# EAGLE design targetboard2 (EAGLE 6.5.0)
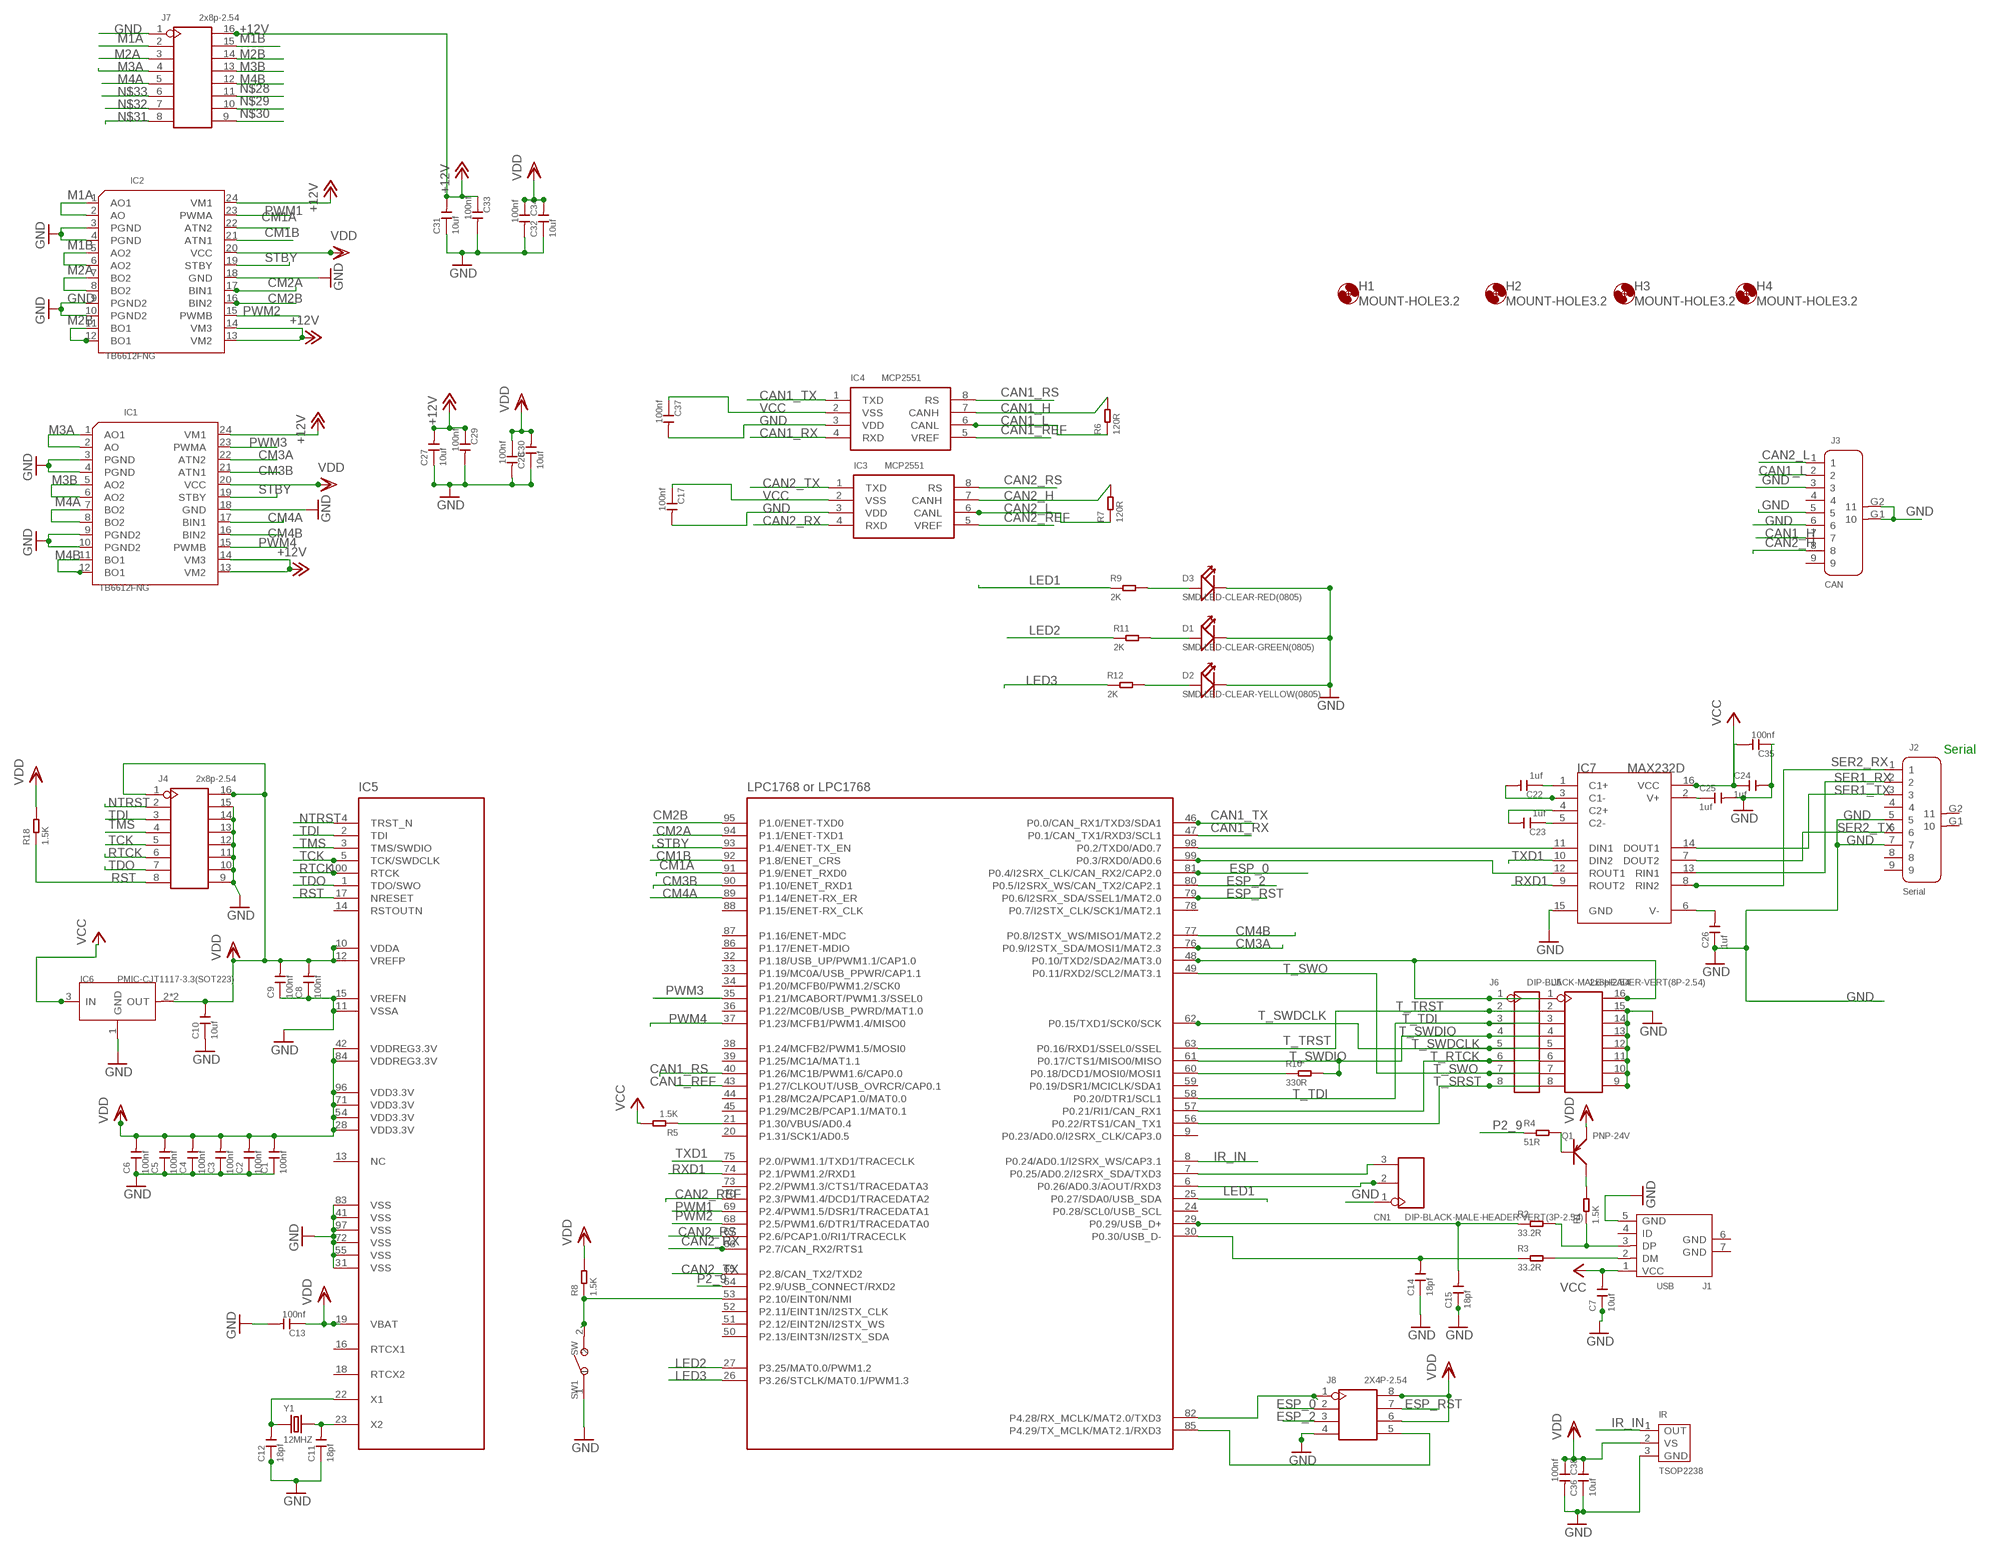
[diagram p0: schematic, sheet 1]

## Parts
C1  100nf  CERAMIC-100NF-50V-10%-X7R(0805)  [C0805]
C2  100nf  CERAMIC-100NF-50V-10%-X7R(0805)  [C0805]
C3  100nf  CERAMIC-100NF-50V-10%-X7R(0805)  [C0805]
C4  100nf  CERAMIC-100NF-50V-10%-X7R(0805)  [C0805]
C5  100nf  CERAMIC-100NF-50V-10%-X7R(0805)  [C0805]
C6  100nf  CERAMIC-100NF-50V-10%-X7R(0805)  [C0805]
C7  10uf  CERAMIC-10UF-10V-10%-X5R(0603)  [C0603]
C8  100nf  CERAMIC-100NF-50V-10%-X7R(0805)  [C0805]
C9  100nf  CERAMIC-100NF-50V-10%-X7R(0805)  [C0805]
C10  10uf  CERAMIC-10UF-25V-10%-X5R(0805)  [C0805]
C11  18pf  CERAMIC-18PF-50V-5%-NPO(0805)  [C0805]
C12  18pf  CERAMIC-18PF-50V-5%-NPO(0805)  [C0805]
C13  100nf  CERAMIC-100NF-50V-10%-X7R(0805)  [C0805]
C14  18pf  CERAMIC-18PF-50V-5%-NPO(0805)  [C0805]
C15  18pf  CERAMIC-18PF-50V-5%-NPO(0805)  [C0805]
C17  100nf  CERAMIC-100NF-50V-10%-X7R(0805)  [C0805]
C22  1uf  CERAMIC-1UF-25V-10%-X7R(0805)  [C0805]
C23  1uf  CERAMIC-1UF-25V-10%-X7R(0805)  [C0805]
C24  1uf  CERAMIC-1UF-25V-10%-X7R(0805)  [C0805]
C25  1uf  CERAMIC-1UF-25V-10%-X7R(0805)  [C0805]
C26  1uf  CERAMIC-1UF-25V-10%-X7R(0805)  [C0805]
C27  10uf  CERAMIC-10UF-25V-10%-X5R(0805)  [C0805]
C28  10uf  CERAMIC-10UF-25V-10%-X5R(0805)  [C0805]
C29  100nf  CERAMIC-100NF-50V-10%-X7R(0805)  [C0805]
C30  100nf  CERAMIC-100NF-50V-10%-X7R(0805)  [C0805]
C31  10uf  CERAMIC-10UF-25V-10%-X5R(0805)  [C0805]
C32  10uf  CERAMIC-10UF-25V-10%-X5R(0805)  [C0805]
C33  100nf  CERAMIC-100NF-50V-10%-X7R(0805)  [C0805]
C34  100nf  CERAMIC-100NF-50V-10%-X7R(0805)  [C0805]
C35  100nf  CERAMIC-100NF-50V-10%-X7R(0805)  [C0805]
C36  10uf  CERAMIC-10UF-25V-10%-X5R(0805)  [C0805]
C37  100nf  CERAMIC-100NF-50V-10%-X7R(0805)  [C0805]
C38  100nf  CERAMIC-100NF-50V-10%-X7R(0805)  [C0805]
CN1  DIP-BLACK-MALE-HEADER-VERT(3P-2.54)  [H3-2.54]
D1  SMD-LED-CLEAR-GREEN(0805)  [LED-0805]
D2  SMD-LED-CLEAR-YELLOW(0805)  [LED-0805]
D3  SMD-LED-CLEAR-RED(0805)  [LED-0805]
H1  MOUNT-HOLE3.2  [3,2]
H2  MOUNT-HOLE3.2  [3,2]
H3  MOUNT-HOLE3.2  [3,2]
H4  MOUNT-HOLE3.2  [3,2]
IC1  TB6612FNG  DRIVER-TB6612FNG-O/C8/EL(SSOP24)  [SSOP24-0.65-8.9X5.3MM]
IC2  TB6612FNG  DRIVER-TB6612FNG-O/C8/EL(SSOP24)  [SSOP24-0.65-8.9X5.3MM]
IC3  MCP2551  INTERFACE-MCP2551-I/SN(SOIC8)  [SOIC8-1.27-5X4MM]
IC4  MCP2551  INTERFACE-MCP2551-I/SN(SOIC8)  [SOIC8-1.27-5X4MM]
IC5  LPC1768 or LPC1768  MCU_LPC1768FBD100(LQFP100)  [LQFP100-0.5-13.8X13.8MM]
IC6  PMIC-CJT1117-3.3(SOT223)  [SOT-223]
IC7  MAX232D  RECEIVER-MAX232D(SOIC16)  [SOIC16-1.27-10X3.9MM]
IR  TSOP2238  OPTICAL-TSOP2238  [SNR3-2.54-6.95X6.0X5.6MM]
J1  USB  MICRO-USB-SMD-TYPE-AB-R/A(ST-USB-001L)  [MICRO-USB5+2P-SMD-0.65]
J2  Serial  DIP-MALE-DB9-CONNECTOR  [DSUB9+2P-2.77-90D-MALE]
J3  CAN  DIP-MALE-DB9-CONNECTOR  [DSUB9+2P-2.77-90D-MALE]
J4  2x8p-2.54  DIP-BLACK-MALE-HEADER-VERT(2X8P-2.54)  [H2X8-2.54]
J5  2x8p-2.54  DIP-BLACK-MALE-HEADER-VERT(2X8P-2.54)  [H2X8-2.54]
J6  DIP-BLACK-MALE-HEADER-VERT(8P-2.54)  [H8-2.54]
J7  2x8p-2.54  DIP-BLACK-MALE-HEADER-VERT(2X8P-2.54)  [H2X8-2.54]
J8  2X4P-2.54  DIP-BLACK-FEMALE-HEADER(2X4P-2.54)  [H2X4-2.54]
Q1  PNP-24V  SMD-TRANSISTORS-PNP-25V-500MA(SOT-23)  [SOT-23]
R1  1.5K  SMD-RES-1.5K-5%-1/16W(0402)  [R0402]
R2  33.2R  SMD-RES-33.2R-1%-1/10W(0603)  [R0603]
R3  33.2R  SMD-RES-33.2R-1%-1/10W(0603)  [R0603]
R4  51R  SMD-RES-51R-1%-1/10W(0603)  [R0603]
R5  1.5K  SMD-RES-1.5K-5%-1/16W(0402)  [R0402]
R6  120R  SMD-RES-120R-5%-1/8W(0805)  [R0805]
R7  120R  SMD-RES-120R-5%-1/8W(0805)  [R0805]
R8  1.5K  SMD-RES-1.5K-5%-1/16W(0402)  [R0402]
R9  2K  SMD-RES-2K-5%-1/8W(0805)  [R0805]
R10  330R  SMD-RES-330R-1%-1/10W(0603)  [R0603]
R11  2K  SMD-RES-2K-5%-1/8W(0805)  [R0805]
R12  2K  SMD-RES-2K-5%-1/8W(0805)  [R0805]
R18  1.5K  SMD-RES-1.5K-5%-1/16W(0402)  [R0402]
SW1  SW  SMD-BUTTON(2P-3.0X2.5X1.2+0.4MM)-B3U-1000P-2P-SMD  [SW2-2.6-3.0X2.5X1.2+0.4MM]
Y1  12MHZ  SMD-CRYSTAL-12MHZ-20PF-20PPM-40R(2P-5.0X3.2MM)  [X2-SMD-5.0X3.2X1.3MM]

## Nets
+12V: C27.2 C29.1 C31.2 C33.1 IC1.13(VM2) IC1.14(VM3) IC1.24(VM1) IC2.13(VM2) IC2.14(VM3) IC2.24(VM1) J7.16
CAN1_H: IC4.7(CANH) J3.7 R6.2
CAN1_L: IC4.6(CANL) J3.2 R6.1
CAN1_REF: IC4.5(VREF) IC5.43(P1.27/CLKOUT/USB_OVRCR/CAP0.1)
CAN1_RS: IC4.8(RS) IC5.40(P1.26/MC1B/PWM1.6/CAP0.0)
CAN1_RX: IC4.4(RXD) IC5.47(P0.1/CAN_TX1/RXD3/SCL1)
CAN1_TX: IC4.1(TXD) IC5.46(P0.0/CAN_RX1/TXD3/SDA1)
CAN2_H: IC3.7(CANH) J3.8 R7.2
CAN2_L: IC3.6(CANL) J3.1 R7.1
CAN2_REF: IC3.5(VREF) IC5.70(P2.3/PWM1.4/DCD1/TRACEDATA2)
CAN2_RS: IC3.8(RS) IC5.67(P2.6/PCAP1.0/RI1/TRACECLK)
CAN2_RX: IC3.4(RXD) IC5.66(P2.7/CAN_RX2/RTS1)
CAN2_TX: IC3.1(TXD) IC5.65(P2.8/CAN_TX2/TXD2)
CM1A: IC2.22(ATN2) IC5.91(P1.9/ENET_RXD0)
CM1B: IC2.21(ATN1) IC5.92(P1.8/ENET_CRS)
CM2A: IC2.17(BIN1) IC5.94(P1.1/ENET-TXD1)
CM2B: IC2.16(BIN2) IC5.95(P1.0/ENET-TXD0)
CM3A: IC1.22(ATN2) IC5.76(P0.9/I2STX_SDA/MOSI1/MAT2.3)
CM3B: IC1.21(ATN1) IC5.90(P1.10/ENET_RXD1)
CM4A: IC1.17(BIN1) IC5.89(P1.14/ENET-RX_ER)
CM4B: IC1.16(BIN2) IC5.77(P0.8/I2STX_WS/MISO1/MAT2.2)
DM: J1.2(DM) R3.2
DP: J1.3(DP) R1.1 R2.2
EDM: C14.2 IC5.30(P0.30/USB_D-) R3.1
EDP: C15.2 IC5.29(P0.29/USB_D+) R2.1
ESP_0: IC5.81(P0.4/I2SRX_CLK/CAN_RX2/CAP2.0) J8.2
ESP_2: IC5.80(P0.5/I2SRX_WS/CAN_TX2/CAP2.1) J8.3
ESP_RST: IC5.79(P0.6/I2SRX_SDA/SSEL1/MAT2.0) J8.7
GND: C1.1 C2.1 C3.1 C4.1 C5.1 C6.1 C7.1 C8.1 C9.1 C10.1 C11.1 C12.1 C13.2 C14.1 C15.1 C17.2 C24.2 C25.2 C26.1 C27.1 C28.1 C29.2 C30.2 C31.1 C32.1 C33.2 C34.2 C35.1 C36.1 C37.2 C38.2 CN1.1 D1.- D2.- D3.- IC1.3(PGND) IC1.4(PGND) IC1.9(PGND2) IC1.10(PGND2) IC1.18(GND) IC2.3(PGND) IC2.4(PGND) IC2.9(PGND2) IC2.10(PGND2) IC2.18(GND) IC3.3(VDD) IC4.3(VDD) IC5.11(VSSA) IC5.15(VREFN) IC5.31(VSS) IC5.41(VSS) IC5.55(VSS) IC5.72(VSS) IC5.83(VSS) IC5.97(VSS) IC6.1(GND) IC7.15(GND) IR.3(GND) J1.5(GND) J2.5 J2.7 J3.3 J3.5 J3.6 J3.G1 J3.G2 J4.9 J4.10 J4.11 J4.12 J4.13 J4.14 J4.15 J5.9 J5.10 J5.11 J5.12 J5.13 J5.14 J5.15 J7.1 J8.4 SW1.1
IR_IN: IC5.8(P0.24/AD0.1/I2SRX_WS/CAP3.1) IR.1(OUT)
LED1: IC5.25(P0.27/SDA0/USB_SDA) R9.1
LED2: IC5.27(P3.25/MAT0.0/PWM1.2) R11.1
LED3: IC5.26(P3.26/STCLK/MAT0.1/PWM1.3) R12.1
M1A: IC2.1(AO1) IC2.2(AO) J7.2
M1B: IC2.5(AO2) IC2.6(AO2) J7.15
M2A: IC2.7(BO2) IC2.8(BO2) J7.3
M2B: IC2.11(BO1) IC2.12(BO1) J7.14
M3A: IC1.1(AO1) IC1.2(AO) J7.4
M3B: IC1.5(AO2) IC1.6(AO2) J7.13
M4A: IC1.7(BO2) IC1.8(BO2) J7.5
M4B: IC1.11(BO1) IC1.12(BO1) J7.12
N$1: IC5.48(P0.10/TXD2/SDA2/MAT3.0) J5.1 J5.16 J6.1
N$2: IC5.53(P2.10/EINT0N/NMI) R8.1 SW1.2
N$3: D2.+ R12.2
N$4: D1.+ R11.2
N$5: D3.+ R9.2
N$6: C12.2 IC5.22(X1) Y1.1
N$7: Q1.3(C) R1.2
N$8: C11.2 IC5.23(X2) Y1.2
N$9: Q1.1(B) R4.2
N$10: IC5.21(P1.30/VBUS/AD0.4) R5.1
N$11: IC5.85(P4.29/TX_MCLK/MAT2.1/RXD3) J8.5
N$12: IC5.98(P0.2/TXD0/AD0.7) IC7.11(DIN1)
N$13: IC5.99(P0.3/RXD0/AD0.6) IC7.12(ROUT1)
N$15: C23.2 IC7.4(C2+)
N$16: C23.1 IC7.5(C2-)
N$17: C22.1 IC7.1(C1+)
N$18: C22.2 IC7.3(C1-)
N$19: C26.2 IC7.6(V-)
N$20: C25.1 IC7.2(V+)
N$22: IC5.60(P0.18/DCD1/MOSI0/MOSI1) R10.1
N$23: IC5.82(P4.28/RX_MCLK/MAT2.0/TXD3) J8.1
N$28: J7.11
N$29: J7.10
N$30: J7.9
N$31: J7.8
N$32: J7.7
N$33: J7.6
NTRST: IC5.4(TRST_N) J4.2
P2_9: IC5.64(P2.9/USB_CONNECT/RXD2) R4.1
PWM1: IC2.23(PWMA) IC5.69(P2.4/PWM1.5/DSR1/TRACEDATA1)
PWM2: IC2.15(PWMB) IC5.68(P2.5/PWM1.6/DTR1/TRACEDATA0)
PWM3: IC1.23(PWMA) IC5.35(P1.21/MCABORT/PWM1.3/SSEL0)
PWM4: IC1.15(PWMB) IC5.37(P1.23/MCFB1/PWM1.4/MISO0)
RST: IC5.17(NRESET) J4.8 R18.1
RTCK: IC5.100(RTCK) J4.6
RX3: CN1.2 IC5.6(P0.26/AD0.3/AOUT/RXD3)
RXD1: IC5.74(P2.1/PWM1.2/RXD1) IC7.9(ROUT2)
SER1_RX: IC7.13(RIN1) J2.2
SER1_TX: IC7.14(DOUT1) J2.3
SER2_RX: IC7.8(RIN2) J2.1
SER2_TX: IC7.7(DOUT2) J2.6
STBY: IC1.19(STBY) IC2.19(STBY) IC5.93(P1.4/ENET-TX_EN)
T_RTCK: IC5.57(P0.21/RI1/CAN_RX1) J5.6 J6.6
T_SRST: IC5.56(P0.22/RTS1/CAN_TX1) J5.8 J6.8
T_SWDCLK: IC5.62(P0.15/TXD1/SCK0/SCK) J5.5 J6.5
T_SWDIO: IC5.61(P0.17/CTS1/MISO0/MISO) J5.4 J6.4 R10.2
T_SWO: IC5.49(P0.11/RXD2/SCL2/MAT3.1) J5.7 J6.7
T_TDI: IC5.58(P0.20/DTR1/SCL1) J5.3 J6.3
T_TRST: IC5.63(P0.16/RXD1/SSEL0/SSEL) J5.2 J6.2
TCK: IC5.5(TCK/SWDCLK) J4.5
TDI: IC5.2(TDI) J4.3
TDO: IC5.1(TDO/SWO) J4.7
TMS: IC5.3(TMS/SWDIO) J4.4
TX3: CN1.3 IC5.7(P0.25/AD0.2/I2SRX_SDA/TXD3)
TXD1: IC5.75(P2.0/PWM1.1/TXD1/TRACECLK) IC7.10(DIN2)
VCC: C7.2 C17.1 C24.1 C35.2 C37.1 IC3.2(VSS) IC4.2(VSS) IC6.3(IN) IC7.16(VCC) J1.1(VCC) R5.2
VDD: C1.2 C2.2 C3.2 C4.2 C5.2 C6.2 C8.2 C9.2 C10.2 C13.1 C28.2 C30.1 C32.2 C34.1 C36.2 C38.1 IC1.20(VCC) IC2.20(VCC) IC5.10(VDDA) IC5.12(VREFP) IC5.19(VBAT) IC5.28(VDD3.3V) IC5.42(VDDREG3.3V) IC5.54(VDD3.3V) IC5.71(VDD3.3V) IC5.84(VDDREG3.3V) IC5.96(VDD3.3V) IC6.2(OUT) IC6.TER(OUT) IR.2(VS) J4.1 J4.16 J8.6 J8.8 Q1.2(E) R8.2 R18.2
Unconnected: IC5.9(P0.23/AD0.0/I2SRX_CLK/CAP3.0) IC5.13(NC) IC5.14(RSTOUTN) IC5.16(RTCX1) IC5.18(RTCX2) IC5.20(P1.31/SCK1/AD0.5) IC5.24(P0.28/SCL0/USB_SCL) IC5.32(P1.18/USB_UP/PWM1.1/CAP1.0) IC5.33(P1.19/MC0A/USB_PPWR/CAP1.1) IC5.34(P1.20/MCFB0/PWM1.2/SCK0) IC5.36(P1.22/MC0B/USB_PWRD/MAT1.0) IC5.38(P1.24/MCFB2/PWM1.5/MOSI0) IC5.39(P1.25/MC1A/MAT1.1) IC5.44(P1.28/MC2A/PCAP1.0/MAT0.0) IC5.45(P1.29/MC2B/PCAP1.1/MAT0.1) IC5.50(P2.13/EINT3N/I2STX_SDA) IC5.51(P2.12/EINT2N/I2STX_WS) IC5.52(P2.11/EINT1N/I2STX_CLK) IC5.59(P0.19/DSR1/MCICLK/SDA1) IC5.73(P2.2/PWM1.3/CTS1/TRACEDATA3) IC5.78(P0.7/I2STX_CLK/SCK1/MAT2.1) IC5.86(P1.17/ENET-MDIO) IC5.87(P1.16/ENET-MDC) IC5.88(P1.15/ENET-RX_CLK) J1.4(ID) J1.6(GND) J1.7(GND) J2.4 J2.8 J2.9 J2.G1 J2.G2 J3.4 J3.9

## Notes on the sheet
- Serial

## Library data of the parts
C1-C6 C8 C9 C13 C17 C29 C30 C33-C35 C37 C38 = Seeed-OPL-Capacitor:CERAMIC-100NF-50V-10%-X7R(0805): 302010165; MPN: CC0805KRX7R9BB104
C7 = Seeed-OPL-Capacitor:CERAMIC-10UF-10V-10%-X5R(0603): 302010103; MPN: CC0603KRX5R6BB106
C10 C27 C28 C31 C32 C36 = Seeed-OPL-Capacitor:CERAMIC-10UF-25V-10%-X5R(0805): 302010178; MPN: CC0805KKX5R8BB106
C11 C12 C14 C15 = Seeed-OPL-Capacitor:CERAMIC-18PF-50V-5%-NPO(0805): 302010162
C22-C26 = Seeed-OPL-Capacitor:CERAMIC-1UF-25V-10%-X7R(0805): 302010179; MPN: CC0805KKX7R8BB105
CN1 = Seeed-OPL-Connector:DIP-BLACK-MALE-HEADER-VERT(3P-2.54): 320020079
D1 = Seeed-OPL-Diode:SMD-LED-CLEAR-GREEN(0805): 304090057; MPN: 17-215SYGC/S530-E2/TR8
D2 = Seeed-OPL-Diode:SMD-LED-CLEAR-YELLOW(0805): 304090039; MPN: 17-215UYC/S530-A3/TR8
D3 = Seeed-OPL-Diode:SMD-LED-CLEAR-RED(0805): 304090046; MPN: 17-215SURC/S530-A2/TR8
H1-H4 = holes:MOUNT-HOLE: MOUNTING HOLE with drill center marker
IC1 IC2 = Seeed-OPL-ic:DRIVER-TB6612FNG-O/C8/EL(SSOP24): 310040007; MPN: TB6612FNG-O/C8/EL
IC3 IC4 = Seeed-OPL-ic:INTERFACE-MCP2551-I/SN(SOIC8): 310070024; MPN: MCP2551-I/SN
IC5 = Seeed-OPL-ic:MCU_LPC1768FBD100(LQFP100): 310010001; MPN: LPC1768FBD100
IC6 = Seeed-OPL-ic:PMIC-CJT1117-3.3(SOT223): 310030097; MPN: CJT1117-3.3
IC7 = Seeed-OPL-ic:RECEIVER-MAX232D(SOIC16): 310060023; MPN: MAX232D
IR = Seeed-OPL-sensor:OPTICAL-TSOP2238: 314020045
J1 = Seeed-OPL-Connector:MICRO-USB-SMD-TYPE-AB-R/A(ST-USB-001L): 320010012; MPN: ST-USB-001L
J2 J3 = Seeed-OPL-Connector:DIP-MALE-DB9-CONNECTOR: 320110017
J4 J5 J7 = Seeed-OPL-Connector:DIP-BLACK-MALE-HEADER-VERT(2X8P-2.54): 320020045; MPN: P125-1216A0AS116A1
J6 = Seeed-OPL-Connector:DIP-BLACK-MALE-HEADER-VERT(8P-2.54): 320020080; MPN: P125-1108A1BS116A1
J8 = Seeed-OPL-Connector:DIP-BLACK-FEMALE-HEADER(2X4P-2.54): 320030087
Q1 = Seeed-OPL-Transistor:SMD-TRANSISTORS-PNP-25V-500MA(SOT-23): 305020006; MPN: S8550
R1 R5 R8 R18 = Seeed-OPL-Resistor:SMD-RES-1.5K-5%-1/16W(0402): 301010001; MPN: RC0402JR-071K5L
R2 R3 = Seeed-OPL-Resistor:SMD-RES-33.2R-1%-1/10W(0603): 301010687; MPN: RC0603FR-0733R2L
R4 = Seeed-OPL-Resistor:SMD-RES-51R-1%-1/10W(0603): 301010225; MPN: RC0603FR-0751RL
R6 R7 = Seeed-OPL-Resistor:SMD-RES-120R-5%-1/8W(0805): 301010351; MPN: RC0805JR-07120RL
R9 R11 R12 = Seeed-OPL-Resistor:SMD-RES-2K-5%-1/8W(0805): 301010318; MPN: RC0805JR-072KL
R10 = Seeed-OPL-Resistor:SMD-RES-330R-1%-1/10W(0603): 301010300; MPN: RC0603FR-07330RL
SW1 = Seeed-OPL-Switch:SMD-BUTTON(2P-3.0X2.5X1.2+0.4MM): 311020047
Y1 = Seeed-OPL-crystal-osctllator:SMD-CRYSTAL-12MHZ-20PF-20PPM-40R(2P-5.0X3.2MM): 306010047; MPN: 5032/2P

## Board
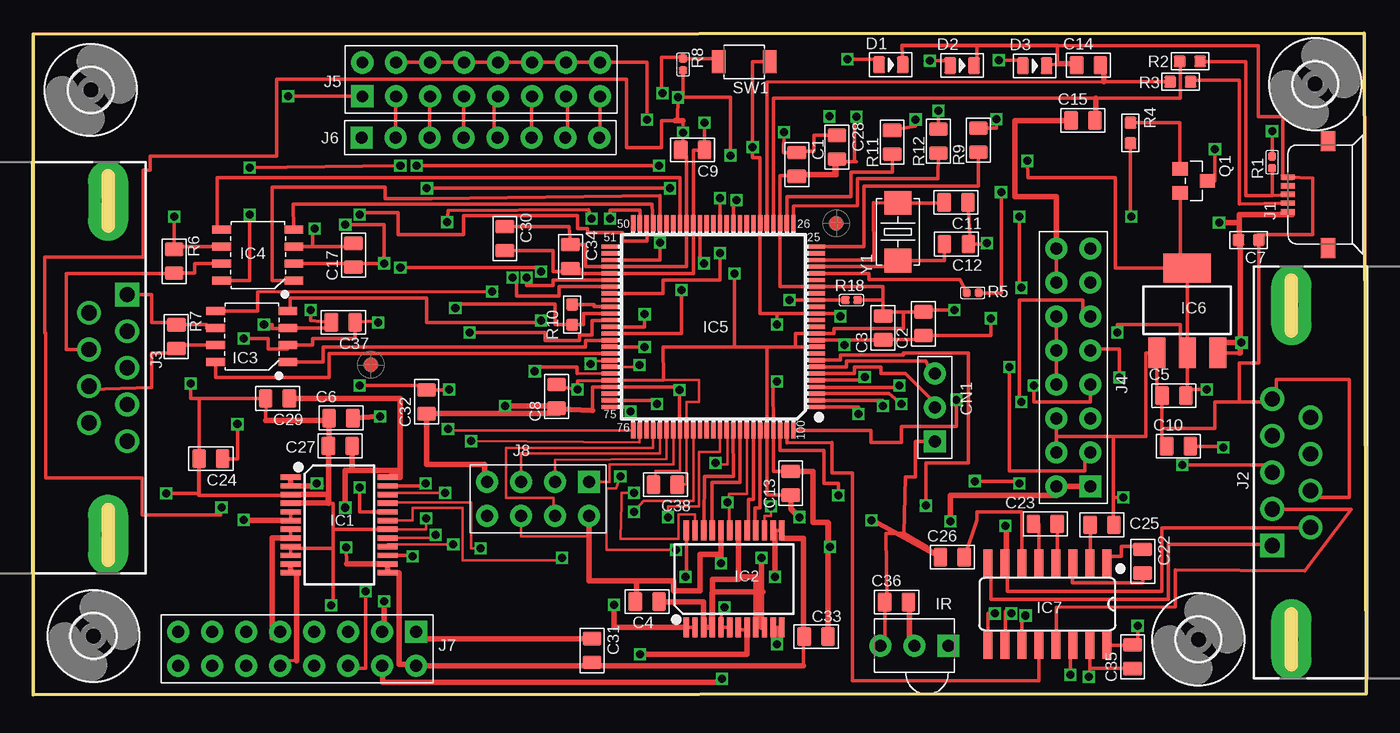
[diagram p1: board, top side]
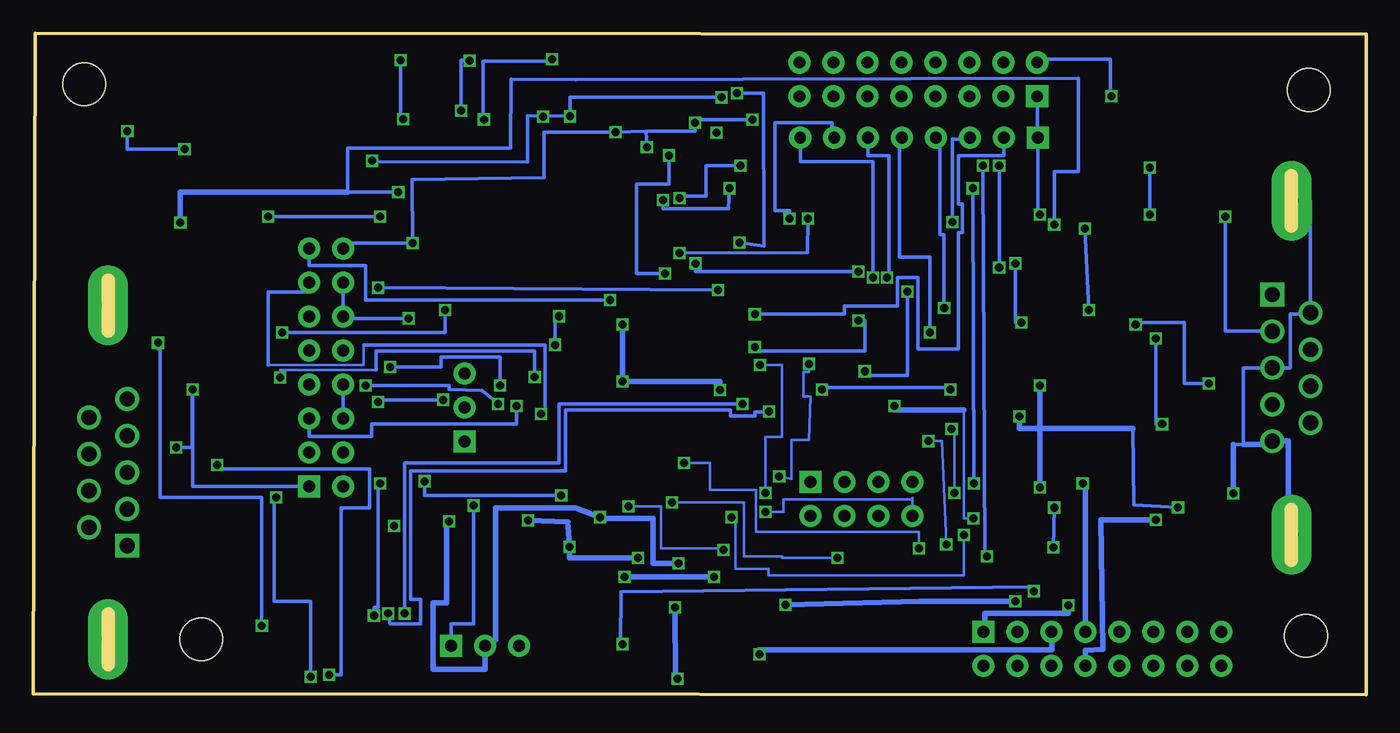
[diagram p2: board, bottom side, seen from below]

Size 99.72 x 49.52 mm. Coordinates in mm from the lower left corner, seen from the top.
Outline: 0,0 99.72,0.1 99.59,49.52 0,49.44 0,0
Copper layers (1*16): Top 0.035mm / dielectric 1.5mm / Bottom 0.035mm
Design rules "SeeedStudio_2layer_DRU_no_angle_20140221": minimum track width 6mil, minimum drill 12mil, track to track 6mil, track to pad 6mil, pad to pad 6mil, via to via 6mil, smd to smd 0mil, copper to edge 10mil, drill to drill 10mil, minimum pad ring 10mil, minimum via ring 6mil, stop-mask expansion 2mil, vias tented up to drill 100mil, thermal gap 10mil

### Footprints (pad centres in the part's own frame; a part is rotated, then mirrored left to right if it is on the bottom)
C0805 = smd 1.397 x 1.016: 1 0,0.889; 2 0,-0.889
C0603 = smd 0.889 x 0.889: 1 0,0.762; 2 0,-0.762
H3-2.54 = drill 0.889 pad 1.651 square: 1 0,2.54 | drill 0.889 pad 1.651: 2 0,0; 3 0,-2.54
LED-0805 = smd 0.889 x 1.27: + -0.889,0; - 0.889,0
3,2 = hole 3.2: 0,0
SSOP24-0.65-8.9X5.3MM = smd 0.4 x 1.5: 1 -3.575,-3.625; 2 -2.925,-3.625; 3 -2.275,-3.625; 4 -1.625,-3.625; 5 -0.975,-3.625; 6 -0.325,-3.625; 7 0.325,-3.625; 8 0.975,-3.625; 9 1.625,-3.625; 10 2.275,-3.625; 11 2.925,-3.625; 12 3.575,-3.625; 13 3.575,3.625; 14 2.925,3.625; 15 2.275,3.625; 16 1.625,3.625; 17 0.975,3.625; 18 0.325,3.625; 19 -0.325,3.625; 20 -0.975,3.625; 21 -1.625,3.625; 22 -2.275,3.625; 23 -2.925,3.625; 24 -3.575,3.625
SOIC8-1.27-5X4MM = smd 0.6 x 1.4: 1 -1.905,-2.7; 2 -0.635,-2.7; 3 0.635,-2.7; 4 1.905,-2.7; 5 1.905,2.7; 6 0.635,2.7; 7 -0.635,2.7; 8 -1.905,2.7
LQFP100-0.5-13.8X13.8MM = smd 1.2 x 0.32: 1 -7.75,6; 2 -7.75,5.5; 3 -7.75,5; 4 -7.75,4.5; 5 -7.75,4; 6 -7.75,3.5; 7 -7.75,3; 8 -7.75,2.5; 9 -7.75,2; 10 -7.75,1.5; 11 -7.75,1; 12 -7.75,0.5; 13 -7.75,0; 14 -7.75,-0.5; 15 -7.75,-1; 16 -7.75,-1.5; 17 -7.75,-2; 18 -7.75,-2.5; 19 -7.75,-3; 20 -7.75,-3.5; 21 -7.75,-4; 22 -7.75,-4.5; 23 -7.75,-5; 24 -7.75,-5.5; 25 -7.75,-6; 51 7.75,-6; 52 7.75,-5.5; 53 7.75,-5; 54 7.75,-4.5; 55 7.75,-4; 56 7.75,-3.5; 57 7.75,-3; 58 7.75,-2.5; 59 7.75,-2; 60 7.75,-1.5; 61 7.75,-1; 62 7.75,-0.5; 63 7.75,0; 64 7.75,0.5; 65 7.75,1; 66 7.75,1.5; 67 7.75,2; 68 7.75,2.5; 69 7.75,3; 70 7.75,3.5; 71 7.75,4; 72 7.75,4.5; 73 7.75,5; 74 7.75,5.5; 75 7.75,6 | smd 0.32 x 1.2: 26 -6,-7.75; 27 -5.5,-7.75; 28 -5,-7.75; 29 -4.5,-7.75; 30 -4,-7.75; 31 -3.5,-7.75; 32 -3,-7.75; 33 -2.5,-7.75; 34 -2,-7.75; 35 -1.5,-7.75; 36 -1,-7.75; 37 -0.5,-7.75; 38 0,-7.75; 39 0.5,-7.75; 40 1,-7.75; 41 1.5,-7.75; 42 2,-7.75; 43 2.5,-7.75; 44 3,-7.75; 45 3.5,-7.75; 46 4,-7.75; 47 4.5,-7.75; 48 5,-7.75; 49 5.5,-7.75; 50 6,-7.75; 76 6,7.75; 77 5.5,7.75; 78 5,7.75; 79 4.5,7.75; 80 4,7.75; 81 3.5,7.75; 82 3,7.75; 83 2.5,7.75; 84 2,7.75; 85 1.5,7.75; 86 1,7.75; 87 0.5,7.75; 88 0,7.75; 89 -0.5,7.75; 90 -1,7.75; 91 -1.5,7.75; 92 -2,7.75; 93 -2.5,7.75; 94 -3,7.75; 95 -3.5,7.75; 96 -4,7.75; 97 -4.5,7.75; 98 -5,7.75; 99 -5.5,7.75; 100 -6,7.75
SOT-223 = smd 1.27 x 2.286: 1 -2.286,-3.175; 2 0,-3.175; 3 2.286,-3.175 | smd 3.556 x 2.159: TER 0,3.175
SOIC16-1.27-10X3.9MM = smd 0.66 x 2.032: 1 -4.445,-3.073; 2 -3.175,-3.073; 3 -1.905,-3.073; 4 -0.635,-3.073; 5 0.635,-3.073; 6 1.905,-3.073; 7 3.175,-3.073; 8 4.445,-3.073; 9 4.445,3.073; 10 3.175,3.073; 11 1.905,3.073; 12 0.635,3.073; 13 -0.635,3.073; 14 -1.905,3.073; 15 -3.175,3.073; 16 -4.445,3.073
SNR3-2.54-6.95X6.0X5.6MM = drill 0.889 pad 1.651 square: 1 0,2.54 | drill 0.889 pad 1.651: 2 0,0; 3 0,-2.54
MICRO-USB5+2P-SMD-0.65 = smd 0.4 x 1.05: 1 -1.3,0; 2 -0.65,0; 3 0,0; 4 0.65,0; 5 1.3,0 | smd 1.5 x 1.1: 6 4,-3; 7 -4,-3
DSUB9+2P-2.77-90D-MALE = drill 1.143 pad 1.778 square: 1 -5.486,1.422 | drill 1.143 pad 1.778: 2 -2.743,1.422; 3 0,1.422; 4 2.743,1.422; 5 5.486,1.422; 6 -4.115,-1.422; 7 -1.372,-1.422; 8 1.372,-1.422; 9 4.115,-1.422 | drill 1 pad 3 long: G1 12.497,0; G2 -12.497,0
H2X8-2.54 = drill 0.889 pad 1.651 square: 1 -1.27,8.89 | drill 0.889 pad 1.651: 2 -1.27,6.35; 3 -1.27,3.81; 4 -1.27,1.27; 5 -1.27,-1.27; 6 -1.27,-3.81; 7 -1.27,-6.35; 8 -1.27,-8.89; 9 1.27,-8.89; 10 1.27,-6.35; 11 1.27,-3.81; 12 1.27,-1.27; 13 1.27,1.27; 14 1.27,3.81; 15 1.27,6.35; 16 1.27,8.89
H8-2.54 = drill 0.889 pad 1.651 square: 1 0,8.89 | drill 0.889 pad 1.651: 2 0,6.35; 3 0,3.81; 4 0,1.27; 5 0,-1.27; 6 0,-3.81; 7 0,-6.35; 8 0,-8.89
H2X4-2.54 = drill 0.889 pad 1.651 square: 1 -1.27,3.81 | drill 0.889 pad 1.651: 2 -1.27,1.27; 3 -1.27,-1.27; 4 -1.27,-3.81; 5 1.27,-3.81; 6 1.27,-1.27; 7 1.27,1.27; 8 1.27,3.81
SOT-23 = smd 1.016 x 1.143: 1 -0.889,-1.016; 2 0.889,-1.016; 3 0,1.016
R0402 = smd 0.635 x 0.635: 1 0,0.445; 2 0,-0.445
R0603 = smd 0.889 x 0.889: 1 0,0.762; 2 0,-0.762
R0805 = smd 1.397 x 1.016: 1 0,0.889; 2 0,-0.889
SW2-2.6-3.0X2.5X1.2+0.4MM = smd 1 x 1.7: 1 -1.9,0; 2 1.9,0
X2-SMD-5.0X3.2X1.3MM = smd 1.778 x 2.032: 1 -2.159,0; 2 2.159,0

### Placement (x,y rotation side)
C1  57.12,39.7 0 top
C2  66.6,27.79 180 top
C3  63.58,27.48 180 top
C4  45.92,6.99 270 top
C5  85.34,22.4 90 top
C6  23.01,20.73 90 top
C7  90.93,34.06 270 top
C8  39.14,22.35 180 top
C9  49.33,40.79 270 top
C10  85.67,18.62 90 top
C11  69.04,36.88 270 top
C12  69.06,33.76 270 top
C13  56.67,15.85 180 top
C14  78.94,47.14 90 top
C15  78.54,43 90 top
C17  23.95,32.92 180 top
C22  83.01,10.01 0 top
C23  75.72,12.8 90 top
C24  13.28,17.68 270 top
C25  79.96,12.73 90 top
C26  68.76,10.31 90 top
C27  22.96,18.64 90 top
C28  60.12,41 0 top
C29  18.26,22.2 270 top
C30  35.28,34.16 0 top
C31  41.81,3.33 0 top
C32  29.41,21.95 180 top
C33  58.57,4.37 90 top
C34  40.18,32.82 0 top
C35  82.25,2.87 180 top
C36  64.59,6.96 90 top
C37  23.19,27.89 270 top
C38  47.29,15.75 270 top
CN1  67.46,21.51 180 top
D1  64.16,47.17 0 top
D2  69.49,47.12 0 top
D3  74.93,47.09 0 top
H1  4.5,4.42 0 top
H2  87.17,4.17 0 top
H3  95.91,45.72 0 top
H4  4.29,45.29 0 top
IC1  22.89,12.73 270 top
IC2  52.43,8.69 0 top
IC3  16.33,26.82 90 top
IC4  16.79,32.92 90 top
IC5  50.88,27.56 180 top
IC6  86.33,28.78 0 top
IC7  75.87,6.81 180 top
IR  65.91,3.68 270 top
J1  93.88,37.47 90 top
J2  94.13,16.66 90 top
J3  5.59,24.49 270 top
J4  77.83,24.51 180 top
J5  33.5,46.08 90 top
J6  33.45,41.71 90 top
J7  19.74,3.45 270 top
J8  37.77,14.68 270 top
Q1  86.82,38.48 270 top
R1  92.68,39.88 180 top
R2  86.54,47.42 90 top
R3  85.83,45.9 90 top
R4  82.09,42.06 180 top
R5  70.28,30.1 90 top
R6  10.54,32.46 0 top
R7  10.69,26.82 0 top
R8  48.62,47.19 0 top
R9  70.71,41.53 180 top
R10  40.31,28.47 0 top
R11  64.26,41.38 180 top
R12  67.72,41.45 180 top
R18  61.21,29.57 90 top
SW1  53.19,47.4 180 top
U$4  [FIDUCIAL_G10]  25.25,24.71 0 top
U$5  [FIDUCIAL_G10]  60.07,35.31 0 top
Y1  64.69,34.67 90 top

### Tracks (layer width: path | path; a pad name or v marks a point on that pad's centre or on a via)
+12V  (via drill 0.6)
  Top 0.279: 32.05,2.18 J7.16 28.63,2.29 | 57.63,2.18 57.63,4.37 C33.1 | 56,11.73 IC2.13 IC2.14 55.5,12.31 | IC1.13 27.38,9.15 | 23.42,9.8 v23.39,11.05 | v48.79,8.84 48.85,8.84 IC2.24 | C31.2 41.91,2.44 41.91,2.18
  Top 0.406: IC1.13 IC1.14 23.42,9.8 | J7.16 41.91,2.18 57.63,2.18 | 57.63,4.37 57.63,11.73 56,11.73 | 27.38,9.15 27.38,2.29 28.63,2.29 | v23.34,14.02 23.34,16.79 23.85,16.79 | 23.85,16.79 27.4,16.79 IC1.24 27.46,16.3 27.46,22.2 C29.1 | 55.5,12.31 v55.5,8.84 | 23.85,16.79 C27.2
  Bottom 0.279: v23.39,11.05 v23.34,14.02
  Bottom 0.406: v55.5,8.84 v48.79,8.84
CAN1_H
  Top 0.279: IC4.7 14.09,32.31 12.06,32.31 12.06,31.57 R6.2 10.54,31.55 2.46,31.55 2.46,25.86 J3.7
CAN1_L  (via drill 0.6)
  Top 0.279: IC4.6 10.54,33.55 | 10.54,33.55 R6.1 | v10.54,35.81 10.54,33.55
  Bottom 0.279: J3.2 10.54,27.23 v10.54,35.81
CAN1_REF
  Top 0.279: IC4.5 13.74,34.82 13.74,38.71 48.38,38.71 IC5.43
CAN1_RS  (via drill 0.6)
  Top 0.279: IC4.8 16.18,31.01 v16.18,35.97 | v16.18,39.47 v27.46,39.62 | v27.46,32 37.82,32 v37.97,31.7 | v50.16,32.31 49.88,32.31 IC5.40
  Bottom 0.279: v16.18,35.97 v16.18,39.47 | v27.46,39.62 v27.46,32 | v37.97,31.7 50.16,31.7 v50.16,32.31
CAN1_RX
  Top 0.254: 46.3,36.73 19.44,36.73
  Top 0.279: IC5.47 46.35,35.31 46.3,36.73 | 19.44,36.73 IC4.4
CAN1_TX
  Top 0.279: IC4.1 17.86,31.01 17.88,37.97 17.88,38 26.31,38 26.31,37.16 29.79,37.16 46.88,37.39 IC5.46
CAN2_H
  Top 0.279: IC3.7 10.69,26.19 | J3.8 4.17,22.86 8.86,23.01 8.86,25.6 10.24,25.6 10.24,26.19 10.69,26.19 | 10.69,26.19 R7.2
CAN2_L
  Top 0.279: J3.1 8.86,29.97 8.86,27.89 10.69,27.89 R7.1 12.98,27.71 12.98,27.43 13.63,27.43 IC3.6
CAN2_REF  (via drill 0.6)
  Top 0.178: 40.67,24.08 43.13,24.08
  Top 0.279: IC3.5 16.79,28.73 16.79,30.18 v34.32,30.2 | 40.67,24.08 40.67,24.54 37.52,24.54 v37.52,24.23 | 43.13,24.08 IC5.70
  Bottom 0.279: v34.32,30.2 34.32,23.93 37.52,23.93 v37.52,24.23
CAN2_RS
  Top 0.279: IC5.67 22.12,25.56 22.12,23.77 13.63,23.77 IC3.8
CAN2_RX  (via drill 0.6)
  Top 0.279: IC3.4 19.23,28.73 19.23,29.72 29.44,29.72 29.44,27.89 37.97,27.89 v37.97,28.04 | v45.75,26.06 IC5.66
  Bottom 0.279: v37.97,28.04 37.52,28.04 37.52,25.76 45.75,25.76 v45.75,26.06
CAN2_TX
  Top 0.279: IC3.1 21.67,24.92 21.67,26.06 41.33,26.06 41.33,26.52 43.13,26.52 IC5.65
CM1A
  Top 0.279: IC5.91 52.35,19.81 52.37,16.36 50.23,16.36 50.19,12.93 50.15,12.93 IC2.22
CM1B
  Top 0.279: IC2.21 50.77,12.31 50.77,15.93 52.88,15.93 IC5.92
CM2A
  Top 0.279: IC2.17 53.52,12.31 53.52,14.63 53.88,14.63 IC5.94
CM2B
  Top 0.279: IC2.16 53.97,12.31 53.97,14.02 54.38,14.02 IC5.95
CM3A  (via drill 0.6)
  Top 0.178: IC5.76 31.01,19.81 v31.01,19.91 | v30.81,15.14 26.51,15.14 IC1.22
  Bottom 0.178: v31.01,19.91 30.81,19.91 v30.81,15.14
CM3B  (via drill 0.6)
  Top 0.178: IC5.90 51.94,19.81 51.94,17.27 51.03,17.27 v51.03,17.37 | v33.45,10.97 32.74,10.97 32.74,14.43 26.51,14.43 IC1.21
  Bottom 0.178: v51.03,17.37 49.1,17.37 49.1,15.34 45.64,15.34 45.64,12.19 33.45,12.19 v33.45,10.97
CM4A  (via drill 0.6)
  Top 0.178: IC1.17 30.1,11.75 v30.1,11.99 | v47.47,13.31 47.47,14.12 49.81,14.12 49.81,18.19 51.38,18.19 IC5.89
  Bottom 0.178: v30.1,11.99 30.1,8.94 44.73,8.94 44.73,9.45 47.17,9.45 47.17,13.31 v47.47,13.31
CM4B  (via drill 0.6)
  Top 0.178: IC5.77 45.34,19.81 45.34,18.9 v32.74,19 | v31.42,11.28 26.51,11.28 IC1.16
  Bottom 0.178: v32.74,19 31.72,19 v31.42,11.28
DM
  Top 0.279: J1.2 90.25,36.74 90.25,46.02 86.54,46.02 R3.2
DP
  Top 0.279: J1.3 92.68,37.39 | R2.2 87.38,47.4 90.7,47.4 90.7,37.39 92.68,37.39 | 92.68,37.39 R1.1
EDM
  Top 0.279: R3.1 80.11,45.89 54.88,45.87 IC5.30
  Top 0.406: C14.2 80.11,47.14 80.11,45.89
EDP
  Top 0.279: R2.1 85.83,47.42 85.83,44.65 79.5,44.65 55.38,44.65 IC5.29
  Top 0.406: C15.2 79.5,43 79.5,44.65
ESP_0
  Top 0.178: J8.2 39.04,17.58 47.38,17.68 IC5.81
ESP_2
  Top 0.178: J8.3 36.5,18.09 46.88,18.09 IC5.80
ESP_RST
  Top 0.178: J8.7 38.94,14.22 38.94,14.73 35.38,14.73 35.38,18.49 46.38,18.49 IC5.79
GND  (via drill 0.6)
  Top 0.152: IC5.83 48.39,19.89 48.39,19.99 48.34,20.12
  Top 0.178: C38.2 46.56,15.75 46.56,16.76 48.38,16.76 IC5.83 | J8.4 33.76,15.95 | IC1.18 29.39,12.4 v29.39,13.21 | 39.34,21.64 C8.1 39.34,21.06 | IC2.18 | 52.76,8.64 52.76,8.84 | 54.58,7.72 54.58,5.06 IC2.10 54.48,5.06 | 59.46,12.9 59.61,12.9 v59.61,11.07
  Top 0.279: IC1.10 IC1.9 19.26,10.97 22.43,10.97 | C13.2 55.38,16.74 IC5.97 55.35,23.31 55.5,23.47 v55.65,23.47 | J4.11 J4.12 J4.13 | J4.14 76.56,19.36 | 76.56,19.36 J4.15 | 41.83,21.31 41.83,23.06 43.1,23.06 IC5.72 48.18,23.06 v48.34,22.84 48.34,20.12 | 55.65,28.56 IC5.15 60.38,28.56 v60.38,28.35 | 55.65,28.56 54.38,28.56 IC5.31 54.36,35.31 54.36,40.23 53.82,40.23 v53.82,41 53.82,47.4 SW1.1 | C12.1 70.13,33.76 | 70.13,33.76 70.13,33.68 70.1,33.68 C11.1 | 76.56,33.76 J4.9 J4.10 | 70.13,33.76 71.35,33.76 v71.35,33.83 | 54.28,5.21 IC2.9 IC2.10 | v22.28,6.71 22.43,6.71 22.43,10.97 | 22.43,10.97 22.43,12.39 | 22.43,12.39 25.91,12.39 25.93,12.34 26.51,12.34 IC1.18 | IC4.3 20.9,33.55 | 20.9,33.55 23.95,33.55 C17.2 | IR.3 63.7,3.68 C36.1 63.88,6.96 63.78,12.09 65.15,12.09 | 65.15,12.09 66.85,11.07 C26.1 | 62.81,13.06 v62.71,13.06 | IC5.11 60.68,26.56 | 60.68,26.56 63.58,26.56 C3.1 66.6,26.59 C2.1 71.65,26.9 v71.65,28.19 | v55.65,27.74 55.65,28.56 | v60.68,26.21 60.68,26.56 | CN1.1 66.01,18.97 66.01,16.31 65.25,16.31 65.15,12.09 | v20.75,28.8 20.75,28.04 C37.2 22.3,27.46 IC3.3 19.03,27.43 17.86,27.43 17.86,27.74 v17.25,27.74 | v21.06,34.9 20.9,34.9 20.9,33.55 | v9.93,15.09 12.4,15.09 C24.2 | C24.2 12.37,17.68 12.37,14.94 19.26,14.94 IC1.3 | C29.2 12.4,22.2 C24.2 | C29.2 17.4,22.2 17.37,20.55 | 22.1,20.55 C6.1 | C29.2 11.76,22.2 v11.76,23.32 | 22.43,12.39 22.43,14.35 22.07,14.35 | C30.2 38.89,33.27 38.89,31.7 40.18,31.7 C34.2 40.87,31.93 40.87,31.55 43.13,31.55 IC5.55 49.38,31.56 IC5.41 49.38,40.79 C9.1 v50.22,42.82 | J5.15 J5.14 J5.13 J5.12 J5.11 J5.10 J5.9 45.92,47.35 v45.92,43.05 | v56.16,42.14 56.11,40.59 C1.1 57.12,40.69 58.39,40.69 58.39,41.88 C28.1
  Top 0.279: 90.25,21.95 90.25,24.84 91.69,24.87 C7.1 91.62,34.44 95.73,34.44 95.73,38.69 J1.5 94.18,38.66 93.5,38.66 93.5,43.28 91.64,43.28 91.64,48.59 70.61,48.59 | 90.25,21.95 92.99,21.95 92.99,23.62 98.48,23.62 98.48,14.78 95.78,14.78 J2.7 | 90.25,21.95 88.42,21.95 88.42,19.96 84.45,19.96 | 84.45,19.96 C5.1 84.05,22.4 IC6.1 83.24,25.6 83.24,19.36 80.8,19.36 | 80.8,19.36 76.56,19.36 | C35.1 79.04,2.01 | 79.04,2.01 IC7.15 | C25.2 80.8,12.72 80.8,14.78 | 80.8,14.78 80.8,19.36 | 80.8,14.78 v81.56,14.78 | v78.97,1.37 79.04,1.37 79.04,2.01 | C27.1 22.12,18.64 | 21.97,15 21.97,14.38 | 19.26,14.38 IC1.4 | 28.63,4.22 J7.1 | C10.1 84.45,18.62 84.45,19.96 | 64.97,48.59 64.97,48.64 76.63,48.64 76.63,47.27 D3.- | D1.- 64.97,48.59 | 64.97,48.59 70.61,48.59 | D2.- 70.61,47.3 70.61,48.59
  Top 0.406: C26.1 62.81,13.06 | 17.37,20.55 22.1,20.55 | 22.12,18.64 C6.1 | 22.07,14.35 C27.1 | IC1.3 21.97,15 | 21.97,14.38 19.26,14.38 | C31.1 28.63,4.22 | 92.99,21.95 92.71,21.95 J2.5 | C15.1 73.46,43 73.46,37.29 76.56,37.29 J4.9 | 76.63,47.27 78.05,47.27 C14.1 | 33.76,15.95 33.76,17.27 29.41,17.27 C32.1 39.34,21.06 | v35.28,21.64 39.34,21.64 | C8.1 40.11,21.36 41.83,21.31 | IC2.18 52.76,8.84 54.05,8.84 IC2.9 | 52.76,8.64 50.83,8.64 50.72,5.06 IC2.3 50.15,6.99 C4.1 | 54.58,7.72 50.8,7.72 IC2.4 | 54.48,5.06 v54.48,10.26 | C13.2 58.34,16.74 58.34,12.9 59.46,12.9 C33.2
  Bottom 0.178: v29.39,13.21 30.1,13.21 30.1,21.34 | 35.28,21.34 v35.28,21.64
  Bottom 0.279: J4.10 J4.11 76.56,28.19 v71.65,28.19 | J4.13 J4.14 | J4.9 76.56,33.83 v71.35,33.83 71.4,38.56 61.49,38.73 61.49,42.14 v56.16,42.14 53.9,42.22 | J7.1 28.52,4.72 | 22.28,6.1 v22.28,6.71 | 59.72,12.95 59.72,12.65 | v60.38,28.35 60.68,28.35 v60.68,26.21 | v20.75,28.8 v21.06,34.9 | J3.G2 4.17,36.98 J3.6 4.17,28.5 5.66,28.5 5.66,24.49 J3.3 9.17,24.49 9.17,18.75 9.93,18.75 | 7.01,18.75 J3.5 | 5.82,14.33 5.59,14.33 J3.G1 | v11.76,23.32 13.59,23.32 13.59,27.89 17.25,27.89 v17.25,27.74 | 53.9,42.22 50.22,42.22 v50.22,42.82 50.22,43.05 v45.92,43.05 | v53.82,41 53.9,42.22 | v81.56,14.78 81.71,14.78 81.71,7.01 78.97,7.01 v78.97,1.37
  Bottom 0.406: 28.52,4.72 28.52,6.1 22.28,6.1 | v48.34,22.84 48.34,23.47 v55.65,23.47 v55.65,27.74 | v62.71,13.06 59.72,12.95 | 9.17,18.75 7.01,18.75 | J3.5 5.82,19 5.82,14.33 | 9.93,18.75 v9.93,15.09 | 30.1,21.34 35.28,21.34 | v54.48,10.26 59.61,10.26 v59.61,11.07 59.72,12.65
IR_IN  (via drill 0.6)
  Top 0.279: IC5.8 60.38,25.06 60.38,25.45 65.1,25.45 65.1,25.6 69.98,25.6 69.98,17.37 66.78,17.37 v66.78,14.17
  Bottom 0.279: v66.78,14.17 66.78,5.33 68.45,5.33 IR.1
LED1
  Top 0.279: IC5.25 62.13,33.56 62.15,38.1 70.71,38.1 R9.1
LED2
  Top 0.279: IC5.27 56.39,37.31 61.16,37.31 61.16,39.14 64.29,39.14 R11.1
LED3
  Top 0.279: IC5.26 56.87,36.6 61.67,36.63 61.65,38.66 67.69,38.63 R12.1
M1A  (via drill 0.6)
  Top 0.279: IC2.2 IC2.1 | J7.2 26.24,4.72
  Top 0.406: IC2.1 43.46,5.06 v43.46,6.74 | 26.24,4.72 v26.24,7.01
  Bottom 0.406: v26.24,7.01 33.4,7.01 v43.46,6.74
M1B  (via drill 0.6)
  Top 0.279: 51.56,0.96 v51.54,1.22 | v51.71,6.55 51.48,6.78 IC2.5 IC2.6
  Top 0.406: J7.15 26.11,0.96 51.56,0.96
  Bottom 0.279: v51.54,1.22 51.69,1.22
  Bottom 0.406: 51.69,1.22 v51.71,6.55
M2A  (via drill 0.6)
  Top 0.279: IC2.7 52.76,4.88 53.4,4.88 IC2.8
  Top 0.406: v45.39,3.05 53.4,3.05 IC2.8
  Bottom 0.279: J7.3 23.49,4.72 | 45.44,3.38 v45.39,3.05
  Bottom 0.406: 23.49,4.72 23.49,3.38 45.44,3.38
M2B  (via drill 0.6)
  Top 0.279: IC2.11 55.65,5.06 | 55.65,5.06 v55.65,3.81 | v24.87,7.77 24.87,1.98 23.55,1.98 J7.14 | 55.65,5.06 IC2.12
  Bottom 0.279: v55.65,3.81 55.8,3.81 55.75,7.72 24.87,8.08 v24.87,7.77
M3A  (via drill 0.6)
  Top 0.279: 21.51,15.65 v21.21,15.85
  Top 0.406: IC1.1 IC1.2 21.51,15.65
  Bottom 0.279: v21.21,15.85 21.01,15.85
  Bottom 0.406: 21.01,15.85 J7.4
M3B  (via drill 0.6)
  Top 0.279: 15.72,13.05 v15.72,13.11 | IC1.6 IC1.5
  Top 0.406: IC1.6 15.72,13.05
  Bottom 0.406: v15.72,13.11 19.84,13.11 19.68,3.4 21.01,3.35 J7.13
M4A
  Top 0.279: IC1.8 IC1.7
  Top 0.406: IC1.8 17.86,11.75 17.86,4.27 18.47,4.27 J7.5
M4B
  Top 0.279: IC1.12 19.71,9.12 | 19.71,2.56 18.47,2.59 J7.12
  Top 0.406: IC1.12 IC1.11 | 19.71,9.12 19.71,2.56
N$1  (via drill 0.6)
  Top 0.254: 40.72,34.9 40.72,35.87 32.18,35.87 32.18,34.44
  Top 0.279: IC5.48 45.9,35.31 45.9,33.98 44.07,33.98 44.07,34.59 41.48,34.59 41.48,34.9 40.72,34.9 | 32.18,34.44 27.3,34.44 27.3,36.12 24.41,36.12 | 24.1,36.12 24.41,36.12 | 24.41,36.12 v24.41,35.97 | J5.1 19.05,44.81 v19.05,44.83
  Bottom 0.279: v24.41,35.97 24.56,35.97 J6.1 24.61,41.71 J5.1 | v19.05,44.83 19.13,44.83 19.13,47.57 24.61,47.57 J5.16
N$2  (via drill 0.6)
  Top 0.279: IC5.53 46.89,32.56 v46.89,33.86 | v47.07,45.06 47.02,45.06 47.02,47.75 48.62,47.75 R8.1 51.29,47.64 SW1.2
  Bottom 0.279: v46.89,33.86 45.06,33.6 45.08,45.03 47.07,45.03 v47.07,45.06
N$3  (via drill 0.6)
  Top 0.279: R12.2 v67.72,43.74 | v67.08,47.47 68.58,47.47 D2.+
  Bottom 0.279: v67.72,43.74 67.72,47.52 66.83,47.52 v67.08,47.47
N$4  (via drill 0.6)
  Top 0.279: R11.2 66.01,42.57 v66.01,43.08 | v60.91,47.57 63.2,47.57 D1.+
  Bottom 0.279: v66.01,43.08 66.07,43.08 66.07,47.45 60.91,47.45 v60.91,47.57
N$5  (via drill 0.6)
  Top 0.279: R9.2 72.06,42.42 v72.06,43.1 | v72.24,47.52 74.04,47.52 D3.+
  Bottom 0.279: v72.06,43.1 72.24,43.1 v72.24,47.52
N$6
  Top 0.279: IC5.22 64.11,32.06 Y1.1 68.17,32.51 C12.2
N$7  (via drill 0.6)
  Top 0.279: Q1.3 88.42,38.48 v88.42,40.84 | v92.68,42.22 R1.2
  Bottom 0.279: v88.42,40.84 92.68,40.84 v92.68,42.22
N$8
  Top 0.279: IC5.23 58.65,32.54 62.89,32.56 62.86,36.85 Y1.2 68.33,36.83 C11.2
N$9
  Top 0.279: R4.2 85.8,42.82 Q1.1
N$10
  Top 0.279: IC5.21 62.51,31.56 62.51,31.09 69.33,31.09 R5.1
N$11  (via drill 0.6)
  Top 0.178: v44.93,13.72 45.64,14.53 49.38,14.53 IC5.85
  Bottom 0.178: J8.5 33.96,14.63 | 33.96,14.73 33.96,14.63 | 33.96,14.63 43.61,14.63 43.61,13.72 v44.93,13.72
N$12  (via drill 0.6)
  Top 0.279: IC5.98 55.88,18.29 59.16,18.29 59.16,15.85 60.22,15.85 v60.22,14.94 | v70.43,16 73.79,16 v73.79,15.85 | v74.24,5.94 73.96,5.94 IC7.11
  Bottom 0.279: v60.22,14.94 70.43,14.94 v70.43,16 | v73.79,15.85 73.94,15.85 73.94,6.55 74.24,6.55 v74.24,5.94
N$13
  Top 0.279: IC5.99 56.41,19.81 56.39,18.87 59.77,18.9 59.77,16.61 61.29,16.61 61.29,1.07 75.23,1.07 IC7.12
N$15
  Top 0.279: IC7.4 76.61,9.88 C23.2
N$16
  Top 0.279: C23.1 75.23,12.8 IC7.5
N$17
  Top 0.279: IC7.1 80.31,9.07 80.34,9.07 80.34,10.36 81.41,10.36 81.41,11.12 83.01,11.12 C22.1
N$18
  Top 0.279: IC7.3 77.75,9.88 77.75,8.38 83.01,8.38 C22.2
N$19
  Top 0.279: C26.2 70.59,13.06 70.59,13.72 73.96,13.72 IC7.6
N$20
  Top 0.279: IC7.2 79.07,9.88 C25.1
N$22
  Top 0.279: R10.1 41.94,29.23 41.94,29.06 IC5.60
N$23
  Top 0.178: IC5.82 47.88,17.27 43.1,17.27 43.1,15.95 J8.1
NTRST  (via drill 0.6)
  Top 0.279: J4.2 78.66,18.16 78.66,16.76 73.02,16.76 v73.02,24.54 | v64.8,23.16 64.49,23.01 58.63,23.01 IC5.4
  Bottom 0.279: v73.02,24.54 69.21,24.54 69.21,25.3 64.8,25.3 v64.8,23.16
P2_9  (via drill 0.6)
  Top 0.279: IC5.64 48.49,27.06 v48.49,30.3 | v73.94,30.48 73.79,30.48 v73.79,35.81 | v82.17,35.81 82.09,35.81 R4.1
  Bottom 0.279: v48.49,30.3 v73.94,30.48 | v73.79,35.81 v82.17,35.81
PWM1  (via drill 0.6)
  Top 0.178: IC5.69 45.34,24.56 v45.34,24.69 | v44.93,15.14 44.02,15.14 44.02,14.43 43.92,11.68 48.29,11.68 48.29,13.51 49.5,13.51 IC2.23
  Bottom 0.178: v45.34,24.69 43.71,24.69 43.71,19.3 44.93,19.3 v44.93,15.14
PWM2  (via drill 0.6)
  Top 0.178: IC2.15 54.69,12.31 54.69,13.41 55.19,13.41 v55.19,14.12 | v48.08,10.87 42.9,10.87 42.9,15.44 43.61,15.44 v43.92,16.36 | v41.68,24.79 41.68,24.99 43.13,24.99 IC5.68
  Bottom 0.178: v55.19,14.12 52.76,14.12 52.76,10.97 48.08,10.97 v48.08,10.87 | v43.92,16.36 43,16.15 43,19.1 41.68,19.1 41.58,22.35 42.09,22.35 42.09,24.18 41.68,24.18 v41.68,24.79
PWM3  (via drill 0.6)
  Top 0.279: IC1.23 29.44,15.65 v29.34,15.85 | v29.44,37.92 v47.62,37.92 | v52.6,37.03 52.38,37.03 IC5.35
  Bottom 0.279: v29.34,15.85 v29.44,37.92 | v47.62,37.92 47.73,36.4 50.42,36.4 50.32,36.42 52.6,36.42 v52.6,37.03
PWM4  (via drill 0.6)
  Top 0.279: IC1.15 28.37,10.45 v28.37,10.36 | v28.68,39.62 v46.81,39.62 | v51.38,37.19 IC5.37
  Bottom 0.279: v28.37,10.36 28.52,10.36 v28.68,39.62 | v46.81,39.62 49.4,39.62 49.4,37.34 51.38,37.34 v51.38,37.19
RST  (via drill 0.6)
  Top 0.279: IC5.17 R18.1 v56.57,29.57
  Bottom 0.279: v56.57,29.57 74.85,29.57 74.85,32.16 79.1,32.16 J4.8
RTCK  (via drill 0.6)
  Top 0.279: IC5.100 59.61,19.81 62.66,19.81 62.66,18.9 64.95,18.9 64.95,20.12 69.06,20.12 v69.06,22.1 | v73.94,21.95 73.79,21.95 73.79,29.57 78.51,29.57 78.51,28.65 79.1,28.65 J4.6
  Bottom 0.279: v69.06,22.1 73.94,22.1 v73.94,21.95
RX3
  Top 0.279: CN1.2 67.46,21.87 65.25,24.08 63.42,24.08 63.42,24.56 61.44,24.56 61.44,24.08 58.65,24.08 IC5.6
RXD1  (via drill 0.6)
  Top 0.279: IC5.74 46.66,22.06 v46.66,21.79 | v71.96,6.1 71.42,6.1 IC7.9
  Bottom 0.279: v46.66,21.79 60.38,21.79 60.38,17.37 71.96,17.37 v71.96,6.1
SER1_RX
  Top 0.279: IC7.13 76.53,3.73 76.53,6.55 85.45,6.6 85.45,9.35 95.15,9.3 98.63,13.89 92.94,13.89 J2.2
SER1_TX  (via drill 0.6)
  Top 0.279: IC7.14 77.6,3.73 v77.6,1.52 | v85.98,17.22 92.94,17.22 J2.3
  Bottom 0.279: v77.6,1.52 76.68,1.52 76.68,14.02 74.55,14.02 74.55,16.92 85.98,16.92 v85.98,17.22
SER2_RX
  Top 0.279: IC7.8 71.65,9.88 71.65,7.16 84.91,7.16 84.91,11.28 92.94,11.28 J2.1
SER2_TX  (via drill 0.6)
  Top 0.279: IC7.7 72.72,9.88 v72.72,12.65 72.87,12.65 72.87,7.77 84.45,7.77 84.45,12.5 95.78,12.5 J2.6
STBY  (via drill 0.6)
  Top 0.178: IC1.19 28.37,13.05 28.37,14.02 32.13,14.02 32.13,10.06 39.55,10.06 v39.55,10.26 | v51.94,14.43 52.1,14.43 IC2.19 52.04,12.31 52.04,15.04 53.38,15.04 IC5.93
  Bottom 0.178: v39.55,10.26 43.71,10.26 43.71,10.36 46.56,10.36 46.56,14.43 v51.94,14.43
T_RTCK  (via drill 0.6)
  Top 0.279: J5.6 37.26,44.65 J6.6 | IC5.57 39.34,30.56 39.34,29.87 36.14,29.87 36.14,31.24 v35.84,31.24
  Bottom 0.279: v35.84,31.24 35.69,31.24 35.69,40.39 37.26,40.39 J6.6
T_SRST  (via drill 0.6)
  Top 0.279: IC5.56 38.89,31.06 38.89,30.63 36.91,30.63 v36.91,31.24 | J6.8 42.39,41.71 J5.8
  Bottom 0.279: v36.91,31.24 36.91,39.93 42.34,39.93 J6.8
T_SWDCLK  (via drill 0.6)
  Top 0.279: J5.5 34.47,44.65 34.47,41.15 34.72,41.15 J6.5 | v32.64,27.13 38.28,27.13 38.28,26.52 40.87,26.52 40.87,26.95 41.78,26.95 41.78,28.04 43.13,28.04 IC5.62
  Bottom 0.279: J6.5 34.92,41.71 34.92,32.77 32.64,32.77 v32.64,27.13
T_SWDIO  (via drill 0.6)
  Top 0.279: R10.2 41.17,27.71 41.17,27.74 | IC5.61 41.17,28.55 41.17,27.74 | J5.4 32.18,44.65 J6.4 | 41.17,27.74 39.04,27.74 39.04,29.26 31.57,29.26 v31.57,28.96
  Bottom 0.279: v31.57,28.96 31.57,34.44 31.88,34.44 31.88,41.76 32.18,41.76 J6.4
T_SWO  (via drill 0.6)
  Top 0.279: J5.7 39.95,44.65 39.95,41.15 39.8,41.15 J6.7 | v43.15,35.66 43.15,36.3 45.38,36.3 IC5.49
  Bottom 0.279: J6.7 39.95,41.71 39.95,42.82 44.22,42.82 44.22,36.27 43.15,36.27 v43.15,35.66
T_TDI  (via drill 0.6)
  Top 0.254: v41.76,35.66 41.53,36.32 31.01,36.27
  Top 0.279: J5.3 29.64,44.65 J6.3 | IC5.58 47.12,30.06 47.12,31.06 51.38,31.06 v51.38,33.07 | 31.01,36.27 30.99,35.76 v30.96,35.41
  Bottom 0.279: v51.38,33.07 41.78,33.1 v41.76,35.66 | v30.96,35.41 30.96,41.6 29.64,41.6 J6.3
T_TRST  (via drill 0.6)
  Top 0.279: J5.2 27.1,44.65 J6.2 | IC5.63 45.75,27.56 v45.75,28.5
  Bottom 0.279: v45.75,28.5 39.04,28.5 39.04,29.11 35.08,29.11 35.08,31.24 33.55,31.24 33.55,25.91 30.51,25.91 30.51,34.59 30.2,34.59 30.2,36.73 30.51,36.73 30.51,40.39 27.1,40.39 J6.2
TCK  (via drill 0.6)
  Top 0.279: IC5.5 62.2,23.56 v62.2,23.8 | v81.25,23.77 81.25,25.91 79.1,25.91 J4.5
  Bottom 0.178: 74.09,24.33 81.25,24.33 v81.25,23.77
  Bottom 0.279: v62.2,23.8 62.2,25.76 74.09,25.76 74.09,24.33
TDI  (via drill 0.6)
  Top 0.279: IC5.2 63.58,22.06 v63.58,21.64
  Bottom 0.279: 63.58,21.79 v63.58,21.64 63.58,20.27 74.4,20.27 74.4,19.36 79.1,19.36 J4.3
TDO  (via drill 0.6)
  Top 0.279: IC5.1 61.75,21.56 v61.75,21.03
  Bottom 0.178: 75.01,26.21 75.01,24.69 82.17,24.69
  Bottom 0.279: v61.75,21.03 61.44,21.03 61.44,26.21 75.01,26.21 | 82.17,24.69 82.17,30.18 79.1,30.18 J4.7
TMS  (via drill 0.6)
  Top 0.279: IC5.3 64.03,22.56 v64.95,21.79 | v74.85,23.16 74.85,21.95 79.1,21.95 J4.4
  Bottom 0.279: v64.95,21.79 64.92,21.77 66.14,22.81 68.61,22.86 68.61,23.16 v74.85,23.16
TX3
  Top 0.279: IC5.7 60.83,24.56 60.83,24.99 66.78,24.99 66.96,24.56 CN1.3
TXD1  (via drill 0.6)
  Top 0.152: IC7.10 72.69,4.29 72.72,4.42
  Top 0.279: IC5.75 44.68,21.56 v44.68,21.23 | v73.18,6.1 72.72,6.25 72.72,4.42
  Bottom 0.279: v44.68,21.23 44.68,21.18 45.75,21.18 45.75,20.88 47.57,20.88 47.57,21.34 59.92,21.34 59.92,16.76 71.5,16.76 71.5,7.16 70.74,7.16 70.74,5.33 73.02,5.33 v73.18,6.1
VCC  (via drill 0.6)
  Top 0.279: IC4.2 23.95,32.28 C17.1 23.95,32.31 v26.24,32.31 26.24,35.2 v23.34,35.2 | IC6.3 90.25,25.6 90.25,26.36 90.25,33.53 C7.2 | 94.18,35.97 J1.1 | R5.2 72.44,30.1 v72.42,37.64 | v25.78,27.89 25.78,28.04 C37.1 24.08,26.67 20.9,26.67 20.9,26.19 IC3.2 19.03,25.91 17.55,25.91 17.55,26.67 v15.72,26.67 | C24.1 15.27,17.68 v15.27,20.27 | IC7.16 82.78,3.73 C35.2 82.63,3.79 v82.63,5.18
  Top 0.406: 90.25,35.36 90.25,35.97 94.18,35.97 | v88.72,35.36 90.25,35.36 | 90.25,33.53 90.25,35.36 | 90.25,25.6 90.3,25.6 90.3,34.16 | 88.6,26.31 88.6,26.36 90.25,26.36 v90.4,26.36
  Bottom 0.279: v72.42,37.64 76.23,37.64 76.23,40.95 64.03,40.95 63.98,46.1 59.16,46.05 21.51,46.18 21.51,39.17 23.34,39.17 v23.34,35.2 | v25.78,27.89 26.24,27.89 v26.24,32.31 | v15.27,20.27 15.72,20.27 v15.72,26.67 | v82.63,5.18 82.63,14.78 90.25,14.78 90.25,25.91 90.4,25.91 v90.4,26.36
  Bottom 0.406: 76.23,37.64 88.72,37.64 v88.72,35.36
VDD  (via drill 0.6)
  Top 0.178: C38.1 48.88,15.75 IC5.84 48.88,21.95 49.81,21.95 49.81,23.57 47.14,23.57 | J8.6 36.5,11.89 41.58,11.89 | C13.1 56.72,14.96 56.72,14.63 | IC2.20 51.43,12.31
  Top 0.279: v31.11,22.86 31.11,22.84 C32.2 29.41,23.16 v24.41,23.16 | 43.02,23.55 40.72,23.52 v40.72,22.86 38.89,23.14 C8.2 | 65.1,28.68 C2.2 66.6,28.8 v68.91,28.8 | 65.1,28.68 63.12,28.68 63.12,28.65 63.58,28.65 | 63.58,29.57 63.58,30.56 IC5.19 55.88,30.56 IC5.28 55.88,38.86 57.12,38.86 | 54.89,26.06 57.02,26.06 | 57.02,26.06 IC5.10 | 65.1,28.68 65.1,27.43 59.92,27.43 59.92,27.06 IC5.12 57.02,27.06 57.02,26.06 | R18.2 63.58,29.57 | 63.58,29.57 63.58,28.65 | IC1.20 24.41,13.7 v24.41,15.54 | 54.89,26.06 IC5.96 54.88,14.96 C13.1 | C36.2 65.56,6.96 | IC6.2 IC6.TER 85.83,31.95 | IC6.2 85.83,25.6 85.83,27.74 81.1,27.74 v81.1,27.13 | C4.2 45.14,6.99 | 51.38,10.52 51.38,12.19 IC2.20 | 25.88,20.85 v25.93,20.85 | C30.1 40.08,35.05 C34.1 41.33,33.71 41.33,32.05 IC5.54 48.88,32.06 IC5.42 48.88,40.34 C9.2 48.64,40.34 v48.62,42.09 48.62,43 47.02,43 47.02,40.97 44.37,40.97 44.37,46.08 18.19,46.08 18.19,40.34 8.74,40.34 8.74,39.27 8.2,39.27 8.2,32.79 0.86,32.79 0.86,27.08 0.94,27.08 0.94,16.26 8.13,16.26 8.13,13.49 14.02,13.49 v14.07,14.05 | 57.12,38.86 C1.2 | 57.12,38.86 60.12,38.86 C28.2 | IC6.2 86.33,22.4 C5.2 86.23,22.86 v87.81,22.86 | 63.58,28.65 C3.2 | 85.83,31.95 80.95,31.95 80.95,38.71 74.4,38.71 v74.37,39.98 | 61.59,39.93 61.44,39.93 | 61.44,39.93 60.07,39.93 60.07,40.08 59.92,40.08 59.92,39.01 57.02,39.01 | Q1.2 85.83,37.59 85.83,31.95 | 54.89,26.06 52.45,26.06 | 52.45,26.06 v52.45,31.55 | v52.15,40.39 52.15,44.73 v48.23,44.73 | v48.23,44.73 48.18,43.05 | 52.45,26.06 47.12,26.06 47.14,23.72 47.14,23.57 43.02,23.55 | 43.02,23.55 IC5.71 | C10.2 89.03,18.62 v89.03,18.52 | v48.23,44.73 48.62,44.68 R8.2
  Top 0.279: v61.59,43.28 61.44,43.28 61.44,39.93
  Top 0.406: 65.56,6.96 65.56,4.12 65.61,3.99 IR.2 | 45.14,6.99 45.14,8.53 | 45.14,8.53 47.88,8.53 47.88,7.8 49.89,7.8 49.89,10.52 51.38,10.52 | C6.2 25.88,20.85 | 48.62,43 48.01,43 48.18,43.05 | 60.07,40.08 60.12,40.08 C28.2 | 45.14,8.53 41.58,8.53 41.58,11.89 J8.8 | v57.33,13.31 56.67,13.92 C13.1 | 51.43,12.31 v51.43,9.86 | 76.53,15.62 J4.16 J4.1 | 76.53,14.94 68.61,14.94 v68.61,13.01
  Bottom 0.152: 87.83,20.7 87.81,20.7 | IR.2 65.91,4.12
  Bottom 0.178: 65.91,4.12 65.15,4.12 | 57.33,13.21 v57.33,13.31
  Bottom 0.279: v31.11,22.86 31.27,23.01 41.02,23.01 v40.72,22.86 | v81.1,27.13 68.91,27.13 v68.91,28.8 | v48.23,44.73 59.56,44.73 v59.56,43.31 62.74,43.36 62.74,39.88 74.5,39.9 | J4.1 87.81,15.62 87.81,20.7 v87.81,22.86 | v52.45,31.55 54.58,31.55 54.58,38.25 52.15,38.25 v52.15,40.39 | v14.07,14.05 17.37,14.22 17.45,19.94 | v89.03,18.52 87.83,18.52 87.83,20.7 87.83,22.89
  Bottom 0.406: v24.41,23.16 v24.41,15.54 | 17.45,19.94 25.93,19.94 v25.93,20.85 | 65.15,4.12 65.15,14.02 59.16,14.02 v57.33,13.31 | v51.43,9.86 53.37,9.86 53.37,13.21 57.33,13.21 | v68.61,13.01 68.81,13.01 68.81,6.91 69.82,6.91 69.82,1.93 65.91,1.93 IR.2